# Altium schematic sheet LCD_GH08172.SchDoc: LCD Display
size A4; Date: 01-DEC-2013; Author: A.B; CompanyName: STMicroelectronics; Organization: Microcontrollers Division; Address1: 12, Rue Jules HOROWITZ; Address2: 38019 Grenoble; Address3: FRANCE; DocumentNumber: MB1184; Revision: C-01; SheetNumber: 6; SheetTotal: 10; Project: STM32L476G-DISCO
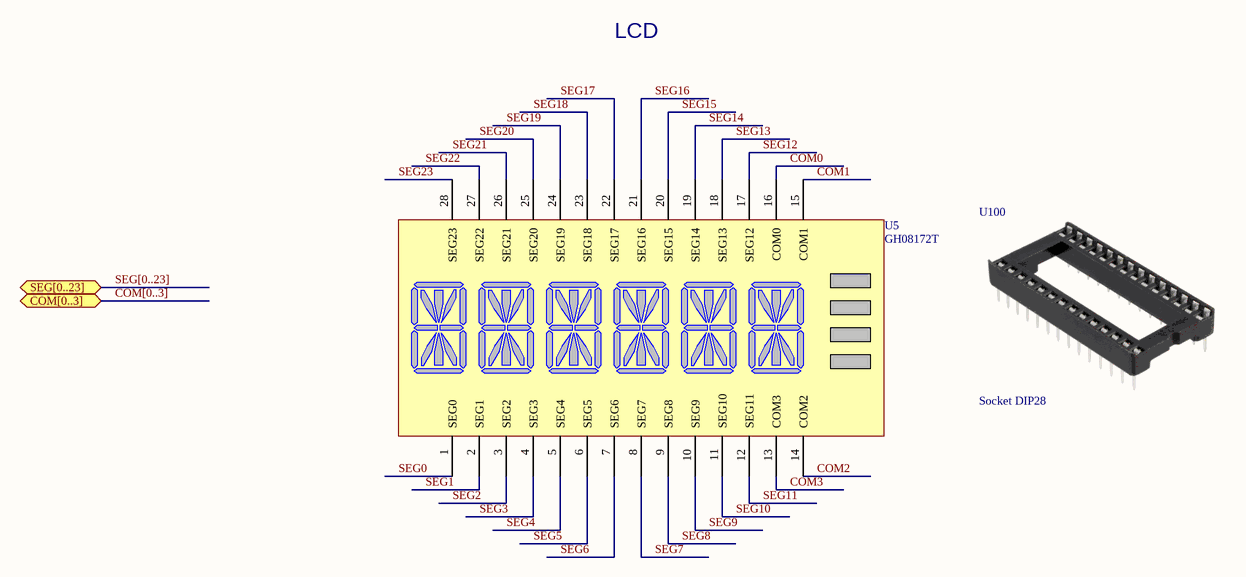
[diagram p0: LCD_GH08172.SchDoc]

## Parts
U5  GH08172T  [DIP28]
U100  Socket DIP28  [DIP28]

## Ports
COM[0..3], SEG[0..23]

## Nets
COM0: U5.16(COM0)
COM1: U5.15(COM1)
COM2: U5.14(COM2)
COM3: U5.13(COM3)
SEG0: U5.1(SEG0)
SEG1: U5.2(SEG1)
SEG2: U5.3(SEG2)
SEG3: U5.4(SEG3)
SEG4: U5.5(SEG4)
SEG5: U5.6(SEG5)
SEG6: U5.7(SEG6)
SEG7: U5.8(SEG7)
SEG8: U5.9(SEG8)
SEG9: U5.10(SEG9)
SEG10: U5.11(SEG10)
SEG11: U5.12(SEG11)
SEG12: U5.17(SEG12)
SEG13: U5.18(SEG13)
SEG14: U5.19(SEG14)
SEG15: U5.20(SEG15)
SEG16: U5.21(SEG16)
SEG17: U5.22(SEG17)
SEG18: U5.23(SEG18)
SEG19: U5.24(SEG19)
SEG20: U5.25(SEG20)
SEG21: U5.26(SEG21)
SEG22: U5.27(SEG22)
SEG23: U5.28(SEG23)

## Buses and harness runs
bus COM[0..3] = port COM[0..3]
bus SEG[0..23] = port SEG[0..23]

## Notes on the sheet
- LCD
- Title:
- Project:
- Size:
- Date:
- A4
- Reference:
- Sheet:
- Revision:
- of

## Library data of the parts
U5 = GH08172T: LCD 6x16 segments, 4 Common, Multiplexed 1/4 Duty, 1/3 Bias, 3V, DIP28; Manuf_1: hzdslcd; Order: GH08172T-B; ECCN_US/EU: EAR99/NEC; Manuf_Part_1: GH08172T-B; Distrib: JIUBABA
U100 = GH08172T_Socket: Socket DIP28 for GH08172T LCD; Manuf_Part_1: ED28DT; Manuf_1: On Shore Technology Inc; Order: ED3052-5-ND; Distrib: DIGIKEY; ECCN_US/EU: n/a